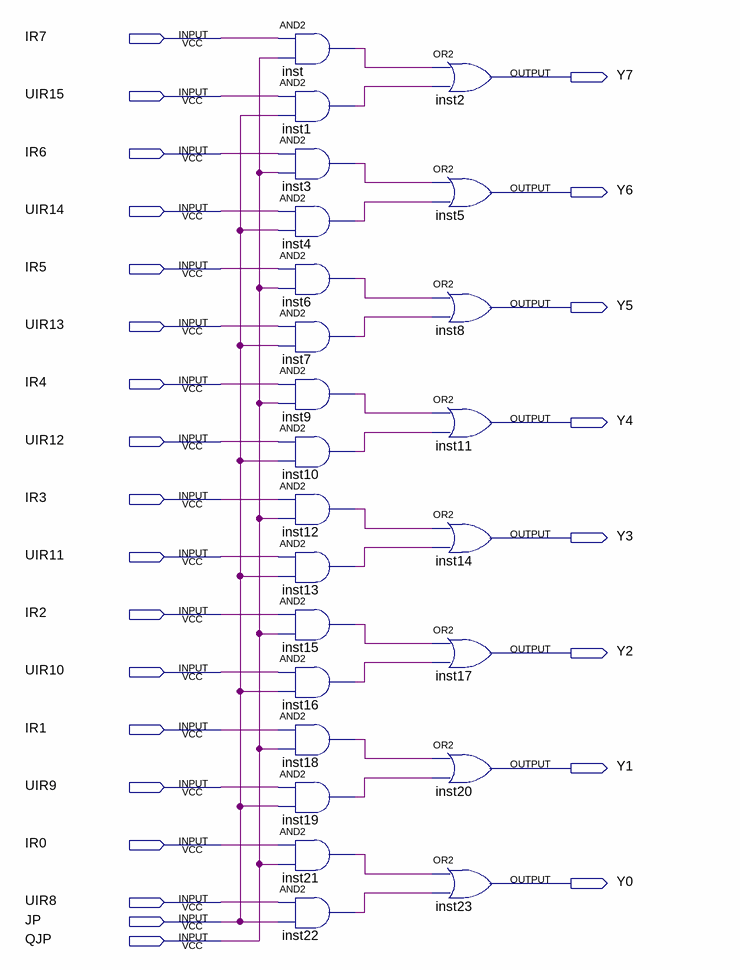
[diagram p0: schematic sheet]
// Quartus schematic adr.bdf as structural Verilog: 24 symbols, 26 pins
module adr (
  input  IR7,
  input  UIR15,
  input  IR6,
  input  UIR14,
  input  IR5,
  input  UIR13,
  input  IR4,
  input  UIR12,
  input  IR3,
  input  UIR11,
  input  IR2,
  input  UIR10,
  input  IR1,
  input  UIR9,
  input  IR0,
  input  UIR8,
  input  JP,
  input  QJP,
  output Y7,
  output Y6,
  output Y5,
  output Y4,
  output Y3,
  output Y2,
  output Y1,
  output Y0
);

  wire inst1_out, inst3_out, inst4_out, inst6_out, inst7_out, inst9_out, inst10_out, inst12_out, inst13_out,
       inst15_out, inst16_out, inst18_out, inst19_out, inst21_out, inst22_out, inst_out;

  and inst (inst_out, IR7, QJP);
  and inst1 (inst1_out, UIR15, JP);
  and inst3 (inst3_out, IR6, QJP);
  and inst4 (inst4_out, UIR14, JP);
  and inst6 (inst6_out, IR5, QJP);
  and inst7 (inst7_out, UIR13, JP);
  and inst9 (inst9_out, IR4, QJP);
  and inst10 (inst10_out, UIR12, JP);
  and inst12 (inst12_out, IR3, QJP);
  and inst13 (inst13_out, UIR11, JP);
  and inst15 (inst15_out, IR2, QJP);
  and inst16 (inst16_out, UIR10, JP);
  and inst18 (inst18_out, IR1, QJP);
  and inst19 (inst19_out, UIR9, JP);
  and inst21 (inst21_out, IR0, QJP);
  and inst22 (inst22_out, UIR8, JP);
  or inst2 (Y7, inst_out, inst1_out);
  or inst5 (Y6, inst3_out, inst4_out);
  or inst8 (Y5, inst6_out, inst7_out);
  or inst11 (Y4, inst9_out, inst10_out);
  or inst14 (Y3, inst12_out, inst13_out);
  or inst17 (Y2, inst15_out, inst16_out);
  or inst20 (Y1, inst18_out, inst19_out);
  or inst23 (Y0, inst21_out, inst22_out);
endmodule
